# Altium schematic sheet OneWifiGameBAT.SchDoc
size A3
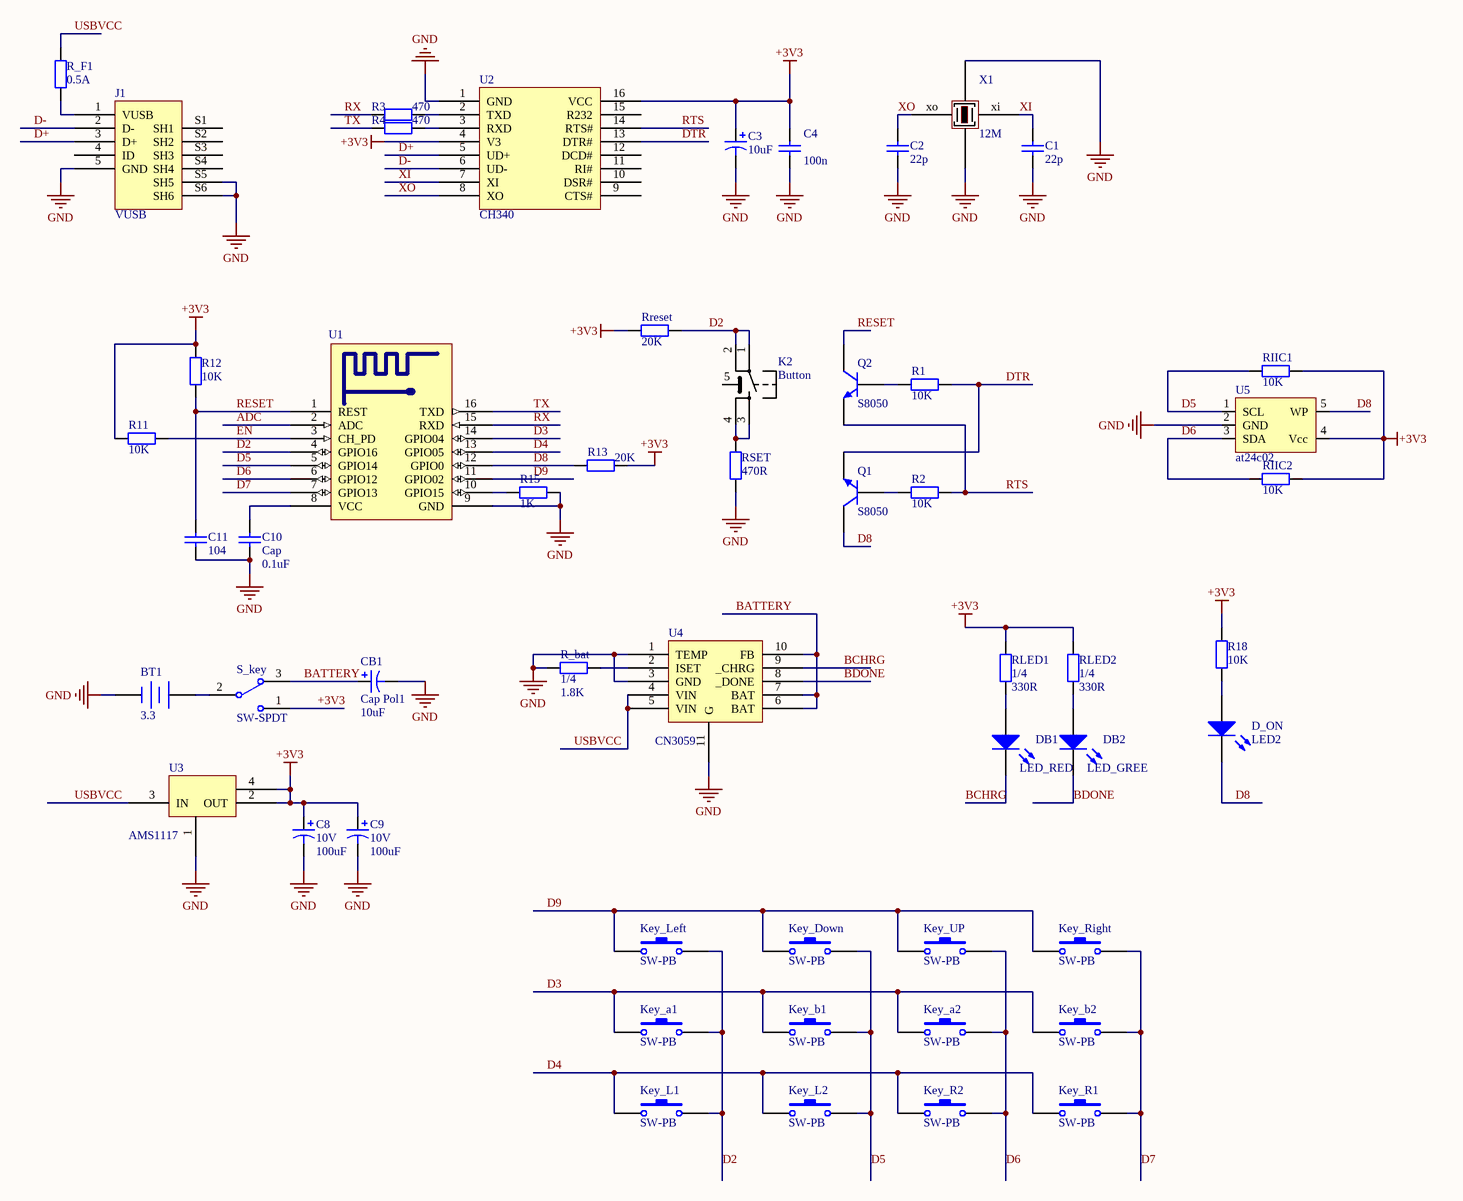
[diagram p0: OneWifiGameBAT.SchDoc]

## Parts
BT1  3.3  [BAT-2]
C1  22p  [RAD-0.3]
C2  22p  [RAD-0.3]
C3  10uF  [RB7.6-15]
C4  100n  [RAD-0.3]
C8  10V  value 100uF  [RB7.6-15]
C9  10V  value 100uF  [RB7.6-15]
C10  Cap  value 0.1uF  [RAD-0.3]
C11  104  [RAD-0.3]
CB1  Cap Pol1  value 10uF  [RB7.6-15]
D_ON  LED2  [DSO-F2/D6.1]
DB1  LED_RED  [DSO-F2/D6.1]
DB2  LED_GREE  [DSO-F2/D6.1]
J1  VUSB
K2  Button
Key_a1  SW-PB  [SPST-2]
Key_a2  SW-PB  [SPST-2]
Key_b1  SW-PB  [SPST-2]
Key_b2  SW-PB  [SPST-2]
Key_Down  SW-PB  [SPST-2]
Key_L1  SW-PB  [SPST-2]
Key_L2  SW-PB  [SPST-2]
Key_Left  SW-PB  [SPST-2]
Key_R1  SW-PB  [SPST-2]
Key_R2  SW-PB  [SPST-2]
Key_Right  SW-PB  [SPST-2]
Key_UP  SW-PB  [SPST-2]
Q1  S8050  [SOT95P240-3N]
Q2  S8050  [SOT95P240-3N]
R1  10K  [AXIAL-0.4]
R2  10K  [AXIAL-0.4]
R3  470  [AXIAL-0.4]
R4  470  [AXIAL-0.4]
R11  10K  [AXIAL-0.4]
R12  10K  [AXIAL-0.4]
R13  20K  [AXIAL-0.4]
R15  1K  [AXIAL-0.4]
R18  10K  [AXIAL-0.4]
R_bat  1/4  value 1.8K  [AXIAL-0.4]
R_F1  0.5A  [AXIAL-0.4]
RIIC1  10k  [AXIAL-0.4]
RIIC2  10k  [AXIAL-0.4]
RLED1  1/4  value 330R  [AXIAL-0.4]
RLED2  1/4  value 330R  [AXIAL-0.4]
Rreset  value 20K  [AXIAL-0.4]  (hidden comment: 10k)
RSET  value 470R  [AXIAL-0.4]  (hidden comment: Res2)
S_key  SW-SPDT  [TL36WW15050]
U1  ESP-12  (value not drawn)
U2  CH340  [CH340]
U3  AMS1117
U4  CN3059  [CN3059]
U5  at24c02
X1  12M  [OSO]

## Nets
+3V3: C3.1 C4.2 C8.1 C9.1 R11.1 R12.2 R13.2 R18.1 RIIC1.1 RIIC2.1 RLED1.2 RLED2.2 Rreset.1 S_key.1 U2.4(V3) U2.16(VCC) U3.2(OUT) U3.4(p4) U5.4(Vcc)
GND: BT1.2(-) C1.1 C2.1 C3.2 C4.1 C8.2 C9.2 C10.1 C11.1 CB1.2 J1.5(GND) J1.S5(SH5) J1.S6(SH6) R15.2 R_bat.2 RSET.1 U1.9(GND) U2.1(GND) U3.1(p1) U4.1(TEMP) U4.3(GND) U4.11(G) U5.2(GND) X1.g1(xo) X1.g2
ADC: U1.2(ADC)
BATTERY: CB1.1 S_key.3 U4.6(BAT) U4.7(BAT) U4.10(FB)
BCHRG: DB1.2(K) U4.9(_CHRG)
BDONE: DB2.2(K) U4.8(_DONE)
D2: K2.1 K2.2 Key_a1.2 Key_L1.2 Key_Left.2 Rreset.2 U1.4(GPIO16)
D3: Key_a1.1 Key_a2.1 Key_b1.1 Key_b2.1 U1.14(GPIO04)
D4: Key_L1.1 Key_L2.1 Key_R1.1 Key_R2.1 U1.13(GPIO05)
D5: Key_b1.2 Key_Down.2 Key_L2.2 RIIC1.2 U1.5(GPIO14) U5.1(SCL)
D6: Key_a2.2 Key_R2.2 Key_UP.2 RIIC2.2 U1.6(GPIO12) U5.3(SDA)
D7: Key_b2.2 Key_R1.2 Key_Right.2 U1.7(GPIO13)
D8: D_ON.2(K) Q1.1(C) R13.1 U1.12(GPIO0) U5.5(WP)
D9: Key_Down.1 Key_Left.1 Key_Right.1 Key_UP.1 U1.11(GPIO02)
D+: J1.3(D+) U2.5(UD+)
D-: J1.2(D-) U2.6(UD-)
DTR: Q1.3(E) R1.2 U2.13(DTR#)
EN: R11.2 U1.3(CH_PD)
RESET: C11.2 Q2.1(C) R12.1 U1.1(REST)
RTS: Q2.3(E) R2.2 U2.14(RTS#)
RX: R3.1 U1.15(RXD)
TX: R4.1 U1.16(TXD)
USBVCC: R_F1.2 U3.3(IN) U4.4(VIN) U4.5(VIN)
XI: C1.2 U2.7(XI) X1.xi(VCC)
XO: C2.2 U2.8(XO) X1.xo(VCC)
NetBT1_1: BT1.1(+) S_key.2
NetC10_2: C10.2 U1.8(VCC)
NetD_ON_1: D_ON.1(A) R18.2
NetDB1_1: DB1.1(A) RLED1.1
NetDB2_1: DB2.1(A) RLED2.1
NetJ1_1: J1.1(VUSB) R_F1.1
NetK2_3: K2.3 K2.4 RSET.2
NetQ1_2: Q1.2(B) R2.1
NetQ2_2: Q2.2(B) R1.1
NetR3_2: R3.2 U2.2(TXD)
NetR4_2: R4.2 U2.3(RXD)
NetR15_1: R15.1 U1.10(GPIO15)
NetR_bat_1: R_bat.1 U4.2(ISET)

Not connected (* = marked no-connect by the designer): J1 4(ID) S1(SH1) S2(SH2) S3(SH3) S4(SH4); K2 5; U2 9(CTS#) 10(DSR#) 11(RI#) 12(DCD#) 15(R232)

## Library data of the parts
BT1 = Battery: Multicell Battery; Published: 24-Mar-1999; LatestRevisionDate: 17-Jul-2002; LatestRevisionNote: Re-released for DXP Platform.; PackageReference: BAT-2; Publisher: Altium Limited
C1 C2 = Cap: Capacitor; Value: 0.01uF; Published: 8-Jun-2000; LatestRevisionDate: 17-Jul-2002; LatestRevisionNote: Re-released for DXP Platform.; PackageReference: RAD-0.3; Publisher: Altium Limited
C3 C8 C9 CB1 = Cap Pol1: Polarized Capacitor (Radial); Published: 8-Jun-2000; LatestRevisionDate: 17-Jul-2002; LatestRevisionNote: Re-released for DXP Platform.; PackageReference: RB7.6-15; Publisher: Altium Limited
  C3: Value: 10uF
C4 C11 = Cap: Capacitor; Value: 0.1uF; Published: 8-Jun-2000; LatestRevisionDate: 17-Jul-2002; LatestRevisionNote: Re-released for DXP Platform.; PackageReference: RAD-0.3; Publisher: Altium Limited
C10 = Cap: Capacitor; Published: 8-Jun-2000; LatestRevisionDate: 17-Jul-2002; LatestRevisionNote: Re-released for DXP Platform.; PackageReference: RAD-0.3; Publisher: Altium Limited
D_ON DB1 DB2 = LED2: Typical RED, GREEN, YELLOW, AMBER GaAs LED; Published: 8-Jun-2000; LatestRevisionDate: 17-Jul-2002; LatestRevisionNote: Re-released for DXP Platform.; PackageVersion: Feb-2002; PackageReference: 3.2X1.6X1.1; Publisher: Altium Limited
K2 = Button: Button key
Key_a1 Key_a2 Key_b1 Key_b2 Key_Down Key_L1 Key_L2 Key_Left Key_R1 Key_R2 Key_Right Key_UP = SW-PB: Switch; Published: 24-Mar-1999; LatestRevisionDate: 17-Jul-2002; LatestRevisionNote: Re-released for DXP Platform.; PackageReference: SPST-2; Publisher: Altium Limited
Q1 Q2 = QNPN: NPN Bipolar Transistor; Published: 8-Jun-2000; LatestRevisionDate: 29-May-2009; LatestRevisionNote: IPC-7351 Footprint Added.; PackageVersion: Aug-1999; PackageReference: SOT-23B; Publisher: Altium Limited; PackageDescription: 3-Pin SOT-23 Package 0.95 mm Pitch, 2.4 mm Lead Span
R1 R2 R11 R12 R18 R_bat RIIC1 RIIC2 RLED1 RLED2 Rreset RSET = Res2: Resistor; Published: 8-Jun-2000; LatestRevisionDate: 17-Jul-2002; LatestRevisionNote: Re-released for DXP Platform.; PackageReference: AXIAL-0.4; Publisher: Altium Limited
  R1 R2 R11 R12 R18 RIIC1 RIIC2: Value: 10K
R3 R4 R_F1 = Res2: Resistor; Value: 1K; Published: 8-Jun-2000; LatestRevisionDate: 17-Jul-2002; LatestRevisionNote: Re-released for DXP Platform.; PackageReference: AXIAL-0.4; Publisher: Altium Limited
R13 R15 = Res2: Resistor; Value: 10K; Published: 8-Jun-2000; LatestRevisionDate: 17-Jul-2002; LatestRevisionNote: Re-released for DXP Platform.; PackageReference: AXIAL-0.4; Publisher: Altium Limited
S_key = SW-SPDT: SPDT Subminiature Toggle Switch, Right Angle Mounting, Vertical Actuation; Published: 24-Mar-1999; LatestRevisionDate: 17-Dec-2003; LatestRevisionNote: Schematic revised, PCB Footprint replaced.; DatasheetVersion: 05-Dec-2000; PackageReference: TL36WW15050; Publisher: Altium Limited; ComponentLink1Description: Manufacturer Link; ComponentLink1URL: http://www.apem.com
U2 = RS232
X1 = oso